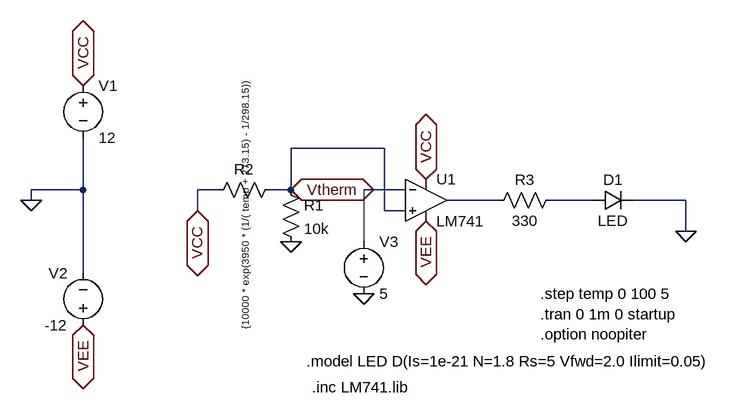
[diagram p0: schematic Thermistor controlled LED using LM741.asc]
Thermistor controlled LED using LM741.asc, the LTspice schematic file:
Version 4.1
SHEET 1 1248 680
WIRE 128 80 -16 80
WIRE -336 144 -336 64
WIRE -336 144 -416 144
WIRE -128 144 -160 144
WIRE -16 144 -16 80
WIRE -16 144 -48 144
WIRE 160 144 96 144
WIRE -416 160 -416 144
WIRE 304 160 224 160
WIRE 448 160 384 160
WIRE 592 160 512 160
WIRE -160 176 -160 144
WIRE 128 176 128 80
WIRE 160 176 128 176
WIRE 592 208 592 160
WIRE 96 224 96 144
WIRE -336 272 -336 144
FLAG 192 128 VCC
IOPIN 192 128 BiDir
FLAG -336 -16 VCC
IOPIN -336 -16 BiDir
FLAG 192 192 VEE
IOPIN 192 192 BiDir
FLAG -336 352 VEE
IOPIN -336 352 BiDir
FLAG -416 160 0
FLAG -16 224 0
FLAG 96 304 0
FLAG 592 208 0
FLAG -16 144 Vtherm
IOPIN -16 144 BiDir
FLAG -160 176 VCC
IOPIN -160 176 BiDir
SYMBOL OpAmps\\opamp2 192 96 R0
SYMATTR InstName U1
SYMATTR Value LM741
SYMBOL voltage -336 -32 R0
WINDOW 123 0 0 Left 0
WINDOW 39 0 0 Left 0
SYMATTR InstName V1
SYMATTR Value 12
SYMBOL voltage -336 368 R180
WINDOW 0 24 96 Left 2
WINDOW 3 24 16 Left 2
WINDOW 123 0 0 Left 0
WINDOW 39 0 0 Left 0
SYMATTR InstName V2
SYMATTR Value -12
SYMBOL res -32 128 R0
SYMATTR InstName R1
SYMATTR Value 10k
SYMBOL res -32 128 R90
WINDOW 0 0 56 VBottom 2
WINDOW 3 41 65 Bottom 1
SYMATTR InstName R2
SYMATTR Value {10000 * exp(3950 * (1/( temp + 273.15) - 1/298.15))}
SYMBOL voltage 96 208 R0
WINDOW 123 0 0 Left 0
WINDOW 39 0 0 Left 0
SYMATTR InstName V3
SYMATTR Value 5
SYMBOL diode 448 176 R270
WINDOW 0 32 32 VTop 2
WINDOW 3 0 32 VBottom 2
SYMATTR InstName D1
SYMATTR Value LED
SYMBOL res 400 144 R90
WINDOW 0 0 56 VBottom 2
WINDOW 3 32 56 VTop 2
SYMATTR InstName R3
SYMATTR Value 330
TEXT 8 408 Left 2 !.model LED D(Is=1e-21 N=1.8 Rs=5 Vfwd=2.0 Ilimit=0.05)
TEXT 16 448 Left 2 !.inc LM741.lib
TEXT 368 304 Left 2 !.step temp 0 100 5\n.tran 0 1m 0 startup\n.option noopiter

The netlist it stands for:
* Thermistor controlled LED using LM741.asc
X§U1 Vtherm N001 VCC VEE N002 LM741  ; pins In+ In- V+ V- OUT
V1 VCC 0 12
V2 VEE 0 -12
R1 Vtherm 0 10k
R2 Vtherm VCC {10000 * exp(3950 * (1/( temp + 273.15) - 1/298.15))}
V3 N001 0 5
D1 N003 0 LED
R3 N003 N002 330
.model D D
.lib standard.dio
.model LED D(Is=1e-21 N=1.8 Rs=5 Vfwd=2.0 Ilimit=0.05)
.inc LM741.lib
.step temp 0 100 5
.tran 0 1m 0 startup
.option noopiter
.backanno
.end